# Altium schematic sheet main.SchDoc
size A3
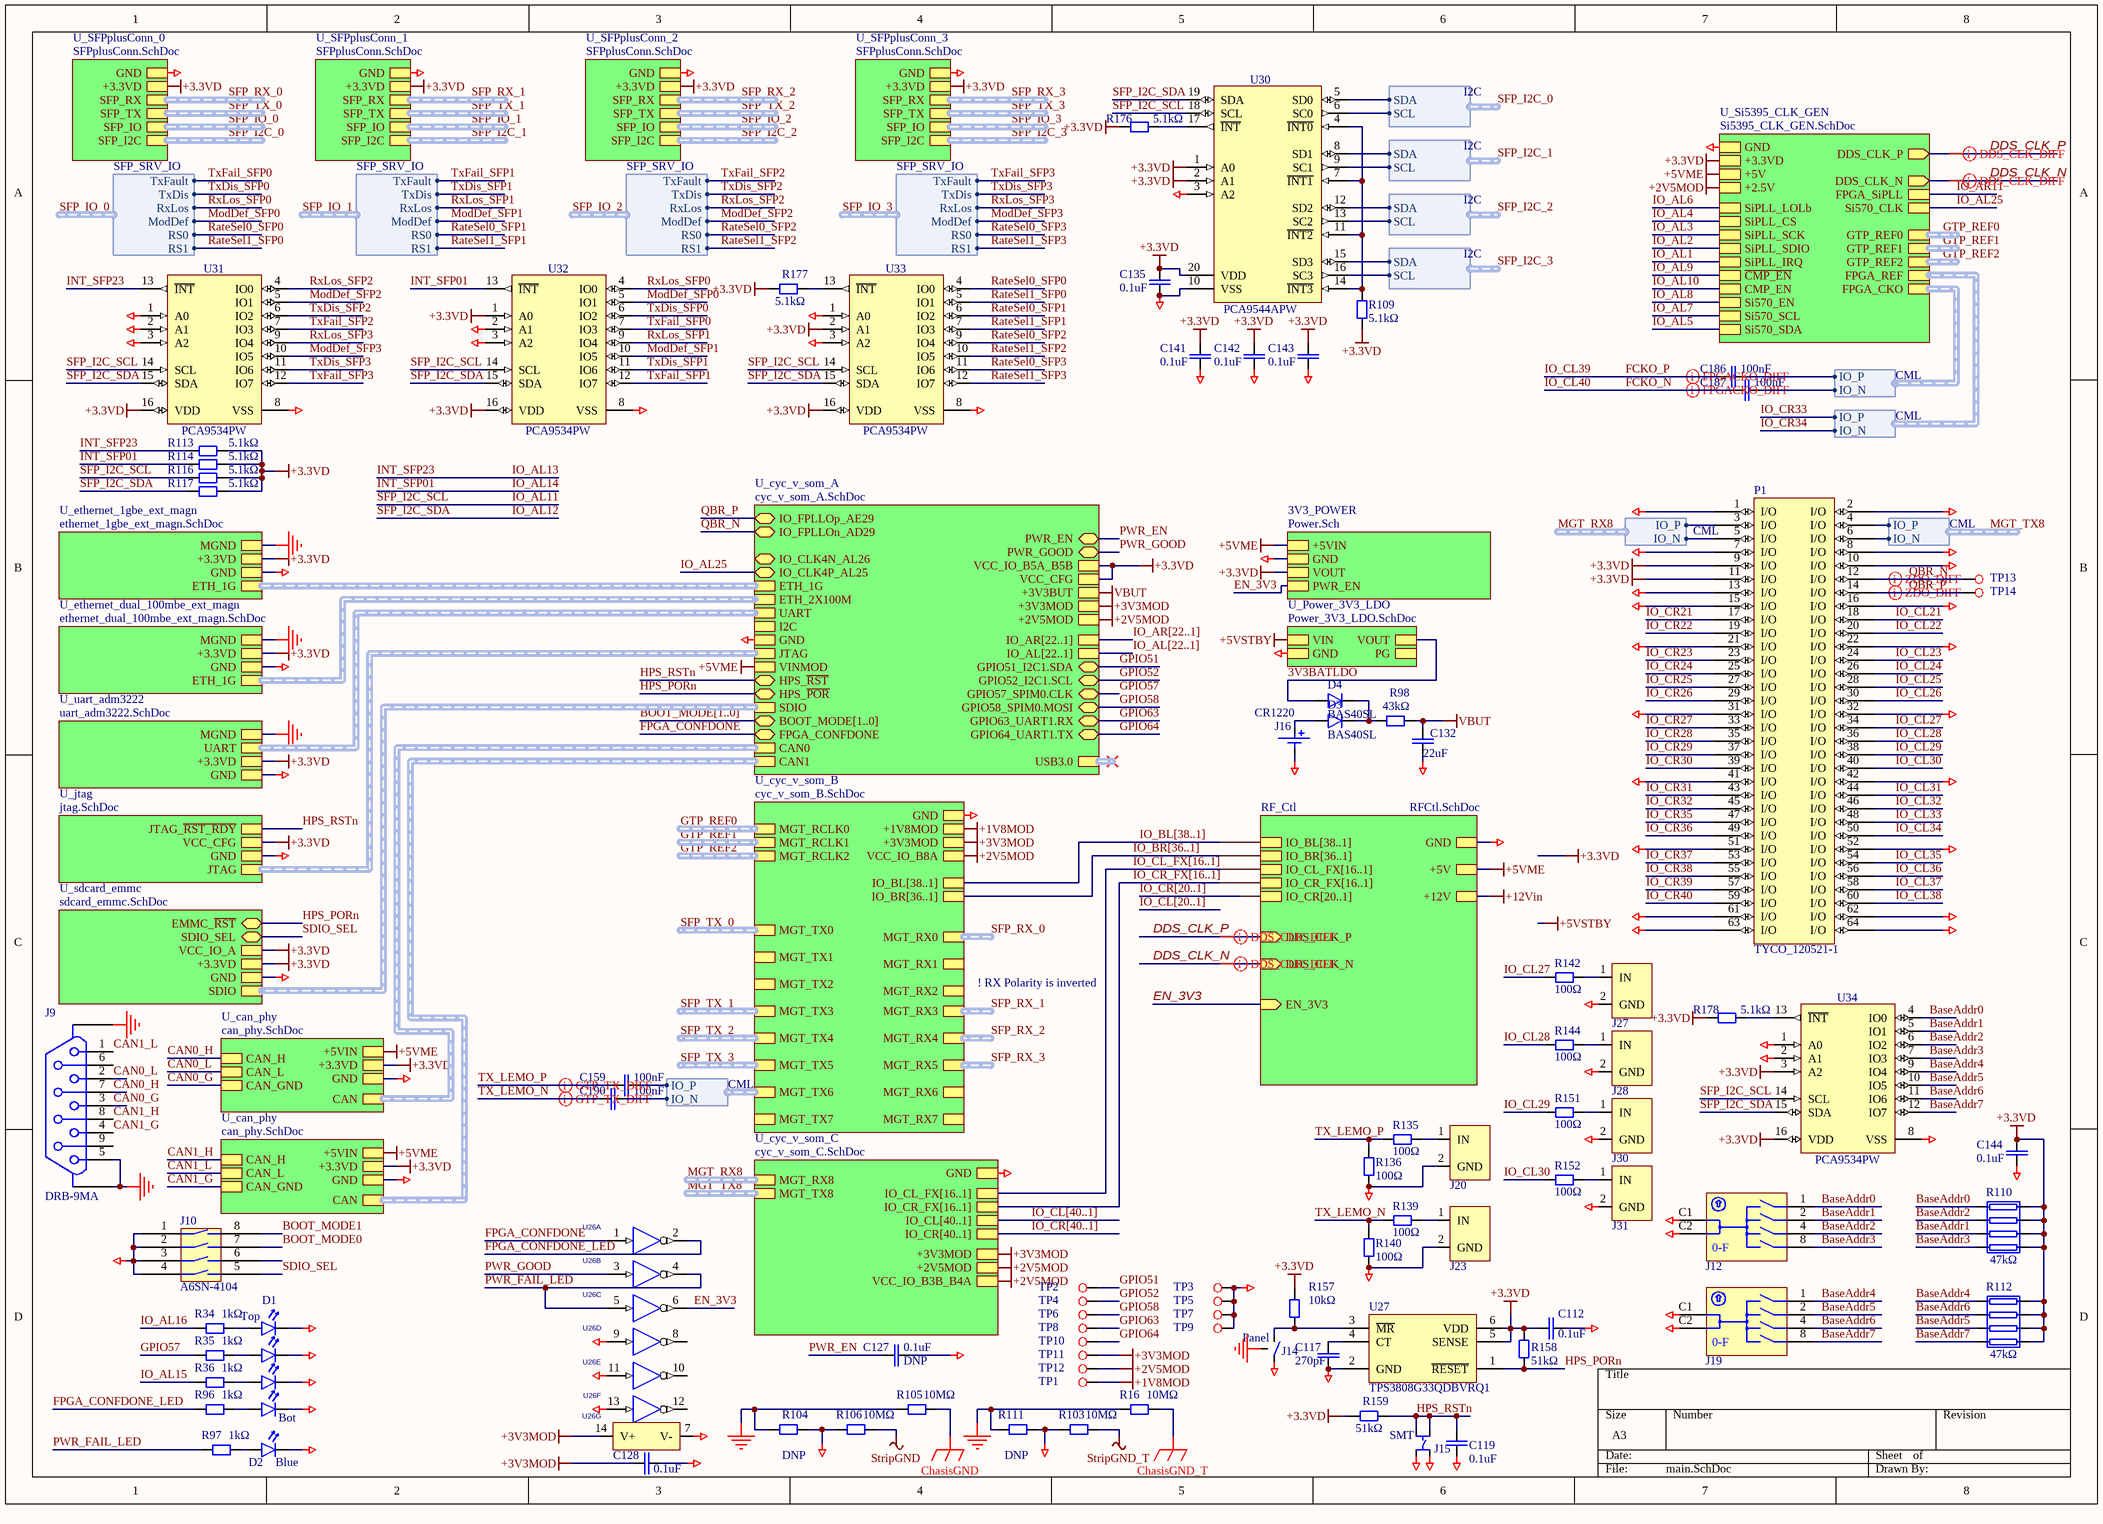
[diagram p0: main.SchDoc]

## Parts
C112  0.1uF  [CAPC2012N]
C117  270pF  [CAPC2012N]
C119  0.1uF  [CAPC2012N]
C127  PartField: 0.1uF  [CAPC2012N]  (hidden comment: DNP)
C128  0.1uF  [CAPC2012N]
C132  22uF  [CAPC2012N]
C135  0.1uF  [CAPC2012N]
C141  0.1uF  [CAPC2012N]
C142  0.1uF  [CAPC2012N]
C143  0.1uF  [CAPC2012N]
C144  0.1uF  [CAPC2012N]
C159  100nF  [CAPC1608N]
C186  100nF  [CAPC1608N]
C187  100nF  [CAPC1608N]
C190  100nF  [CAPC1608N]
D1  H485CGDL  [LED_H485C]  (value not drawn)
D2  Color: Blue  [LEDC1608N]  (hidden comment: LB Q39E-N1OO-35-1)
D3  BAS40SL  [SOD_923]
D4  BAS40SL  [SOD_923]
J9  DRB-9MA  [DRB-9MA]
J10  A6SN-4104  [DIPSW4-A6SN8]
J12  ERD116XSZ  [SW_ECE_ERD116XSZ]  (value not drawn)
J14  PTS645VL582LFS  [PTS645VL582LFS]  (value not drawn)
J15  PTS645SL43SMTR92  [PTS645SL43SMTR92]  (value not drawn)
J16  BC501SM  [BAT_CR1220]  (value not drawn)
J19  ERD116XSZ  [SW_ECE_ERD116XSZ]  (value not drawn)
J20  DNP  [LEMO_EPA.00.250.NTN]  (value not drawn)
J23  DNP  [LEMO_EPA.00.250.NTN]  (value not drawn)
J27  DNP  [LEMO_EPA.00.250.NTN]  (value not drawn)
J28  DNP  [LEMO_EPA.00.250.NTN]  (value not drawn)
J30  DNP  [LEMO_EPA.00.250.NTN]  (value not drawn)
J31  DNP  [LEMO_EPA.00.250.NTN]  (value not drawn)
P1  TYCO_120521-1  [TYCO_120521-1]
R16  10MΩ  [RESC2012N]
R34  1kΩ  [RESC2012N]
R35  1kΩ  [RESC2012N]
R36  1kΩ  [RESC2012N]
R96  1kΩ  [RESC2012N]
R97  1kΩ  [RESC2012N]
R98  43kΩ  [RESC2012N]
R103  10MΩ  [RESC2012N]
R104  DNP  [RESC2012N]
R105  10MΩ  [RESC2012N]
R106  10MΩ  [RESC2012N]
R109  5.1kΩ  [RESC2012N]
R110  value 47kΩ  [CAY16-J4]  (hidden comment: CAY16-4702F4LF)
R111  DNP  [RESC2012N]
R112  value 47kΩ  [CAY16-J4]  (hidden comment: CAY16-4702F4LF)
R113  5.1kΩ  [RESC2012N]
R114  5.1kΩ  [RESC2012N]
R116  5.1kΩ  [RESC2012N]
R117  5.1kΩ  [RESC2012N]
R135  100Ω  [RESC1608N]
R136  100Ω  [RESC1608N]
R139  100Ω  [RESC1608N]
R140  100Ω  [RESC1608N]
R142  100Ω  [RESC1608N]
R144  100Ω  [RESC1608N]
R151  100Ω  [RESC1608N]
R152  100Ω  [RESC1608N]
R157  10kΩ  [RESC2012N]
R158  51kΩ  [RESC2012N]
R159  51kΩ  [RESC2012N]
R176  5.1kΩ  [RESC2012N]
R177  5.1kΩ  [RESC2012N]
R178  5.1kΩ  [RESC2012N]
TP1  test point  [TEST_POINT]  (value not drawn)  (no BOM)
TP2  test point  [TEST_POINT]  (value not drawn)  (no BOM)
TP3  test point  [TEST_POINT]  (value not drawn)  (no BOM)
TP4  test point  [TEST_POINT]  (value not drawn)  (no BOM)
TP5  test point  [TEST_POINT]  (value not drawn)  (no BOM)
TP6  test point  [TEST_POINT]  (value not drawn)  (no BOM)
TP7  test point  [TEST_POINT]  (value not drawn)  (no BOM)
TP8  test point  [TEST_POINT]  (value not drawn)  (no BOM)
TP9  test point  [TEST_POINT]  (value not drawn)  (no BOM)
TP10  test point  [TEST_POINT]  (value not drawn)  (no BOM)
TP11  test point  [TEST_POINT]  (value not drawn)  (no BOM)
TP12  test point  [TEST_POINT]  (value not drawn)  (no BOM)
TP13  test point  [TEST_POINT]  (value not drawn)  (no BOM)
TP14  test point  [TEST_POINT]  (value not drawn)  (no BOM)
U26  SN74LVC04APW  [SOP65P640X110-14N]  (value not drawn)  (parts A,B,C,D,E,F,G of 7)
U27  TPS3808G33QDBVRQ1  [SOT95P280X100-6N]
U30  PCA9544APW  [SOP65P640X110-20N]
U31  PCA9534PW  [SOP65P640X110-16N]
U32  PCA9534PW  [SOP65P640X110-16N]
U33  PCA9534PW  [SOP65P640X110-16N]
U34  PCA9534PW  [SOP65P640X110-16N]

## Sub-sheets
3V3_POWER = Power.Sch: +5VIN, GND, VOUT, PWR_EN
RF_Ctl = RFCtl.SchDoc: IO_CR[20..1], IO_BL[38..1], IO_BR[36..1], IO_CL_FX[16..1], IO_CR_FX[16..1], DDS_CLK_P (in), DDS_CLK_N (in), EN_3V3 (in), GND, +5V, +12V
U_can_phy = can_phy.SchDoc: CAN (harness CAN), GND, +3.3VD, CAN_H, CAN_L, CAN_GND, +5VIN
U_can_phy = can_phy.SchDoc: CAN (harness CAN), GND, +3.3VD, CAN_H, CAN_L, CAN_GND, +5VIN
U_cyc_v_som_A = cyc_v_som_A.SchDoc: ETH_1G (harness EthLanes), ETH_2X100M (harness EthLanes), UART (harness UART), I2C (harness I2C), GND, JTAG (harness JTAG), VINMOD, HPS_~{RST} (bidir), HPS_~{POR} (bidir), SDIO (harness SDIO), BOOT_MODE[1..0] (bidir), FPGA_CONFDONE (bidir), CAN0 (harness CAN), CAN1 (harness CAN), IO_AR[22..1], +2V5MOD, +3V3MOD, GPIO52_I2C1.SCL (bidir), GPIO63_UART1.RX (bidir), GPIO51_I2C1.SDA (bidir), GPIO57_SPIM0.CLK (bidir), GPIO64_UART1.TX (bidir), USB3.0 (harness USB3), GPIO58_SPIM0.MOSI (bidir), +3V3BUT, IO_CLK4N_AL26 (bidir), IO_CLK4P_AL25 (bidir), PWR_EN (bidir), PWR_GOOD (bidir), VCC_IO_B5A_B5B, VCC_CFG, IO_FPLLOp_AE29 (bidir), IO_AL[22..1], IO_FPLLOn_AD29 (bidir)
U_cyc_v_som_B = cyc_v_som_B.SchDoc: GND, MGT_RCLK2 (harness CML), MGT_RCLK1 (harness CML), IO_BL[38..1], IO_BR[36..1], MGT_RCLK0 (harness CML), +1V8MOD, +3V3MOD, VCC_IO_B8A, MGT_TX5 (harness CML), MGT_TX3 (harness CML), MGT_TX6 (harness CML), MGT_TX7 (harness CML), MGT_TX2 (harness CML), MGT_TX1 (harness CML), MGT_TX4 (harness CML), MGT_TX0 (harness CML), MGT_RX0 (harness CML), MGT_RX1 (harness CML), MGT_RX6 (harness CML), MGT_RX4 (harness CML), MGT_RX5 (harness CML), MGT_RX3 (harness CML), MGT_RX2 (harness CML), MGT_RX7 (harness CML)
U_cyc_v_som_C = cyc_v_som_C.SchDoc: GND, MGT_TX8 (harness CML), IO_CL_FX[16..1], IO_CR_FX[16..1], MGT_RX8 (harness CML), IO_CL[40..1], IO_CR[40..1], +3V3MOD, +2V5MOD, VCC_IO_B3B_B4A
U_ethernet_1gbe_ext_magn = ethernet_1gbe_ext_magn.SchDoc: ETH_1G (harness EthLanes), GND, +3.3VD, MGND
U_ethernet_dual_100mbe_ext_magn = ethernet_dual_100mbe_ext_magn.SchDoc: ETH_1G (harness EthLanes), GND, +3.3VD, MGND
U_jtag = jtag.SchDoc: JTAG (harness JTAG), GND, VCC_CFG, JTAG_~{RST_RDY}
U_Power_3V3_LDO = Power_3V3_LDO.SchDoc: GND, VOUT, VIN, PG
U_sdcard_emmc = sdcard_emmc.SchDoc: SDIO (harness SDIO), GND, +3.3VD, VCC_IO_A, SDIO_SEL (bidir), EMMC_~{RST} (bidir)
U_SFPplusConn_0 = SFPplusConn.SchDoc: GND, +3.3VD, SFP_TX (harness CML), SFP_RX (harness CML), SFP_IO (harness SFP_SRV_IO), SFP_I2C (harness I2C)
U_SFPplusConn_1 = SFPplusConn.SchDoc: GND, +3.3VD, SFP_TX (harness CML), SFP_RX (harness CML), SFP_IO (harness SFP_SRV_IO), SFP_I2C (harness I2C)
U_SFPplusConn_2 = SFPplusConn.SchDoc: GND, +3.3VD, SFP_TX (harness CML), SFP_RX (harness CML), SFP_IO (harness SFP_SRV_IO), SFP_I2C (harness I2C)
U_SFPplusConn_3 = SFPplusConn.SchDoc: GND, +3.3VD, SFP_TX (harness CML), SFP_RX (harness CML), SFP_IO (harness SFP_SRV_IO), SFP_I2C (harness I2C)
U_Si5395_CLK_GEN = Si5395_CLK_GEN.SchDoc: GND, +3.3VD, +5V, Si570_CLK, Si570_SCL, Si570_SDA, Si570_EN, ~{CMP_EN}, CMP_EN, +2.5V, FPGA_SiPLL, GTP_REF1 (harness CML), GTP_REF0 (harness CML), GTP_REF2 (harness CML), FPGA_CKO (harness CML), SiPLL_IRQ, SiPLL_SDIO, SiPLL_SCK, SiPLL_CS, FPGA_REF (harness CML), SiPLL_LOLb, DDS_CLK_P (out), DDS_CLK_N (out)
U_uart_adm3222 = uart_adm3222.SchDoc: GND, +3.3VD, UART (harness UART), MGND

## Harnesses
I2C: SDA, SCL
SFP_SRV_IO: TxDis, TxFault, RS0, RS1, ModDef, RxLos
CML: IO_N, IO_P

## Nets
+1V8MOD: TP1.1 ; sheet U_cyc_v_som_B/+1V8MOD
+2V5MOD: TP12.1 ; sheet U_cyc_v_som_A/+2V5MOD, sheet U_cyc_v_som_B/VCC_IO_B8A, sheet U_cyc_v_som_C/+2V5MOD, sheet U_cyc_v_som_C/VCC_IO_B3B_B4A, sheet U_Si5395_CLK_GEN/+2.5V
+3.3VD: C112.2 C135.1 C141.1 C142.1 C143.1 C144.1 P1.9(I/O) P1.11(I/O) R109.2 R110.5 R110.6 R110.7 R110.8 R112.5 R112.6 R112.7 R112.8 R113.2 R114.2 R116.2 R117.2 R157.1 R158.1 R159.1 R176.1 R177.1 R178.1 U27.5(SENSE) U27.6(VDD) U30.1(A0) U30.2(A1) U30.20(VDD) U31.16(VDD) U32.1(A0) U32.16(VDD) U33.2(A1) U33.16(VDD) U34.3(A2) U34.16(VDD) ; sheet U_cyc_v_som_A/VCC_IO_B5A_B5B, sheet U_cyc_v_som_A/VCC_CFG, sheet U_ethernet_1gbe_ext_magn/+3.3VD, sheet U_ethernet_dual_100mbe_ext_magn/+3.3VD, sheet U_uart_adm3222/+3.3VD, sheet U_jtag/VCC_CFG, sheet U_sdcard_emmc/+3.3VD, sheet U_sdcard_emmc/VCC_IO_A, sheet 3V3_POWER/VOUT, sheet U_can_phy/+3.3VD, sheet U_can_phy/+3.3VD, sheet U_SFPplusConn_0/+3.3VD, sheet U_SFPplusConn_1/+3.3VD, sheet U_SFPplusConn_2/+3.3VD, sheet U_SFPplusConn_3/+3.3VD, sheet U_Si5395_CLK_GEN/+3.3VD
+3V3MOD: C128.2 TP11.1 U26.14(V+) ; sheet U_cyc_v_som_A/+3V3MOD, sheet U_cyc_v_som_B/+3V3MOD, sheet U_cyc_v_som_C/+3V3MOD
+5VME: sheet U_cyc_v_som_A/VINMOD, sheet 3V3_POWER/+5VIN, sheet U_can_phy/+5VIN, sheet U_can_phy/+5VIN, sheet U_Si5395_CLK_GEN/+5V, sheet RF_Ctl/+5V
+5VSTBY: sheet U_Power_3V3_LDO/VIN
+12Vin: sheet RF_Ctl/+12V
ChasisGND: R105.2
ChasisGND_T: R16.2
GND: C112.1 C117.2 C119.2 C127.1 C128.1 C132.1 C135.2 C141.2 C142.2 C143.2 C144.2 D1.2(C) D1.4(C) D1.6(C) D1.8(C) D2.1(C) J10.1 J10.2 J10.3 J10.4 J12.C1(C) J12.C2(C) J14.2 J15.3 J15.4 J16.2(-) J19.C1(C) J19.C2(C) J20.2(GND) J23.2(GND) J27.2(GND) J28.2(GND) J30.2(GND) J31.2(GND) P1.1(I/O) P1.2(I/O) P1.7(I/O) P1.8(I/O) P1.10(I/O) P1.13(I/O) P1.15(I/O) P1.16(I/O) P1.21(I/O) P1.22(I/O) P1.31(I/O) P1.32(I/O) P1.41(I/O) P1.42(I/O) P1.51(I/O) P1.52(I/O) P1.61(I/O) P1.62(I/O) P1.63(I/O) P1.64(I/O) R103.1 R104.2 R106.1 R111.2 R136.2 R140.2 TP3.1 TP5.1 TP7.1 TP9.1 U26.7(V-) U26.9(A) U26.11(A) U26.13(A) U27.2(GND) U30.3(A2) U30.10(VSS) U31.1(A0) U31.2(A1) U31.3(A2) U31.8(VSS) U32.2(A1) U32.3(A2) U32.8(VSS) U33.1(A0) U33.3(A2) U33.8(VSS) U34.1(A0) U34.2(A1) U34.8(VSS) ; sheet U_cyc_v_som_A/GND, sheet U_cyc_v_som_B/GND, sheet U_cyc_v_som_C/GND, sheet U_ethernet_1gbe_ext_magn/GND, sheet U_ethernet_dual_100mbe_ext_magn/GND, sheet U_uart_adm3222/GND, sheet U_jtag/GND, sheet U_sdcard_emmc/GND, sheet 3V3_POWER/GND, sheet U_can_phy/GND, sheet U_can_phy/GND, sheet U_Power_3V3_LDO/GND, sheet U_SFPplusConn_0/GND, sheet U_SFPplusConn_1/GND, sheet U_SFPplusConn_2/GND, sheet U_SFPplusConn_3/GND, sheet U_Si5395_CLK_GEN/GND, sheet RF_Ctl/GND
MGND: J9.5 J9.S1(SHLD) J9.S2(SHLD) J14.0(S) R16.1 R104.1 R105.1 R111.1 ; sheet U_ethernet_1gbe_ext_magn/MGND, sheet U_ethernet_dual_100mbe_ext_magn/MGND, sheet U_uart_adm3222/MGND
StripGND: R106.2
StripGND_T: R103.2
VBUT: C132.2 R98.1 ; sheet U_cyc_v_som_A/+3V3BUT
3V3BATLDO: D4.1(A) ; sheet U_Power_3V3_LDO/VOUT
BaseAddr0: J12.1 R110.4 U34.4(IO0)
BaseAddr1: J12.2 R110.2 U34.5(IO1)
BaseAddr2: J12.4 R110.3 U34.6(IO2)
BaseAddr3: J12.8 R110.1 U34.7(IO3)
BaseAddr4: J19.1 R112.4 U34.9(IO4)
BaseAddr5: J19.2 R112.2 U34.10(IO5)
BaseAddr6: J19.4 R112.3 U34.11(IO6)
BaseAddr7: J19.8 R112.1 U34.12(IO7)
BOOT_MODE0: J10.7
BOOT_MODE1: J10.8
CAN0_G: J9.3 ; sheet U_can_phy/CAN_GND
CAN0_H: J9.7 ; sheet U_can_phy/CAN_H
CAN0_L: J9.2 ; sheet U_can_phy/CAN_L
CAN1_G: J9.4 ; sheet U_can_phy/CAN_GND
CAN1_H: J9.8 ; sheet U_can_phy/CAN_H
CAN1_L: J9.1 ; sheet U_can_phy/CAN_L
DDS_CLK_N: sheet U_Si5395_CLK_GEN/DDS_CLK_N, sheet RF_Ctl/DDS_CLK_N
DDS_CLK_P: sheet U_Si5395_CLK_GEN/DDS_CLK_P, sheet RF_Ctl/DDS_CLK_P
EN_3V3: U26.6(B) ; sheet 3V3_POWER/PWR_EN, sheet RF_Ctl/EN_3V3
FCKO_N: C187.1  [also labelled IO_CL40]
FCKO_P: C186.1  [also labelled IO_CL39]
FPGA_CONFDONE: U26.1(A) ; sheet U_cyc_v_som_A/FPGA_CONFDONE
FPGA_CONFDONE_LED: R96.1 U26.2(B)
GPIO51: TP2.1 ; sheet U_cyc_v_som_A/GPIO51_I2C1.SDA
GPIO52: TP4.1 ; sheet U_cyc_v_som_A/GPIO52_I2C1.SCL
GPIO57: R35.1 ; sheet U_cyc_v_som_A/GPIO57_SPIM0.CLK
GPIO58: TP6.1 ; sheet U_cyc_v_som_A/GPIO58_SPIM0.MOSI
GPIO63: TP8.1 ; sheet U_cyc_v_som_A/GPIO63_UART1.RX
GPIO64: TP10.1 ; sheet U_cyc_v_som_A/GPIO64_UART1.TX
HPS_PORn: R158.2 U27.1(~{RESET}) ; sheet U_cyc_v_som_A/HPS_~{POR}, sheet U_sdcard_emmc/EMMC_~{RST}
HPS_RSTn: C119.1 J15.1 J15.2 R159.2 ; sheet U_cyc_v_som_A/HPS_~{RST}, sheet U_jtag/JTAG_~{RST_RDY}
INT_SFP01: R114.1 U32.13(~{INT})  [also labelled IO_AL14]
INT_SFP23: R113.1 U31.13(~{INT})  [also labelled IO_AL13]
IO_AL1: sheet U_Si5395_CLK_GEN/SiPLL_IRQ
IO_AL2: sheet U_Si5395_CLK_GEN/SiPLL_SDIO
IO_AL3: sheet U_Si5395_CLK_GEN/SiPLL_SCK
IO_AL4: sheet U_Si5395_CLK_GEN/SiPLL_CS
IO_AL5: sheet U_Si5395_CLK_GEN/Si570_SDA
IO_AL6: sheet U_Si5395_CLK_GEN/SiPLL_LOLb
IO_AL7: sheet U_Si5395_CLK_GEN/Si570_SCL
IO_AL8: sheet U_Si5395_CLK_GEN/Si570_EN
IO_AL9: sheet U_Si5395_CLK_GEN/~{CMP_EN}
IO_AL10: sheet U_Si5395_CLK_GEN/CMP_EN
IO_AL11: R116.1 U30.18(SCL) U31.14(SCL) U32.14(SCL) U33.14(SCL) U34.14(SCL)  [also labelled SFP_I2C_SCL]
IO_AL12: R117.1 U30.19(SDA) U31.15(SDA) U32.15(SDA) U33.15(SDA) U34.15(SDA)  [also labelled SFP_I2C_SDA]
IO_AL15: R36.1
IO_AL16: R34.1
IO_AL25: sheet U_cyc_v_som_A/IO_CLK4P_AL25, sheet U_Si5395_CLK_GEN/Si570_CLK
IO_AR11: sheet U_Si5395_CLK_GEN/FPGA_SiPLL
IO_CL21: P1.18(I/O)
IO_CL22: P1.20(I/O)
IO_CL23: P1.24(I/O)
IO_CL24: P1.26(I/O)
IO_CL25: P1.28(I/O)
IO_CL26: P1.30(I/O)
IO_CL27: P1.34(I/O) R142.2
IO_CL28: P1.36(I/O) R144.2
IO_CL29: P1.38(I/O) R151.2
IO_CL30: P1.40(I/O) R152.2
IO_CL31: P1.44(I/O)
IO_CL32: P1.46(I/O)
IO_CL33: P1.48(I/O)
IO_CL34: P1.50(I/O)
IO_CL35: P1.54(I/O)
IO_CL36: P1.56(I/O)
IO_CL37: P1.58(I/O)
IO_CL38: P1.60(I/O)
IO_CR21: P1.17(I/O)
IO_CR22: P1.19(I/O)
IO_CR23: P1.23(I/O)
IO_CR24: P1.25(I/O)
IO_CR25: P1.27(I/O)
IO_CR26: P1.29(I/O)
IO_CR27: P1.33(I/O)
IO_CR28: P1.35(I/O)
IO_CR29: P1.37(I/O)
IO_CR30: P1.39(I/O)
IO_CR31: P1.43(I/O)
IO_CR32: P1.45(I/O)
IO_CR33: sheet U_Si5395_CLK_GEN/FPGA_REF.IO_P
IO_CR34: sheet U_Si5395_CLK_GEN/FPGA_REF.IO_N
IO_CR35: P1.47(I/O)
IO_CR36: P1.49(I/O)
IO_CR37: P1.53(I/O)
IO_CR38: P1.55(I/O)
IO_CR39: P1.57(I/O)
IO_CR40: P1.59(I/O)
MGT_RX8.IO_N: P1.5(I/O) ; sheet U_cyc_v_som_C/MGT_RX8.IO_N
MGT_RX8.IO_P: P1.3(I/O) ; sheet U_cyc_v_som_C/MGT_RX8.IO_P
MGT_TX8.IO_N: P1.6(I/O) ; sheet U_cyc_v_som_C/MGT_TX8.IO_N
MGT_TX8.IO_P: P1.4(I/O) ; sheet U_cyc_v_som_C/MGT_TX8.IO_P
ModDef_SFP0: U32.5(IO1) ; sheet U_SFPplusConn_0/SFP_IO.ModDef
ModDef_SFP1: U32.10(IO5) ; sheet U_SFPplusConn_1/SFP_IO.ModDef
ModDef_SFP2: U31.5(IO1) ; sheet U_SFPplusConn_2/SFP_IO.ModDef
ModDef_SFP3: U31.10(IO5) ; sheet U_SFPplusConn_3/SFP_IO.ModDef
PWR_EN: C127.2 ; sheet U_cyc_v_som_A/PWR_EN
PWR_FAIL_LED: R97.1 U26.4(B) U26.5(A)
PWR_GOOD: U26.3(A) ; sheet U_cyc_v_som_A/PWR_GOOD
QBR_N: P1.12(I/O) TP13.1 ; sheet U_cyc_v_som_A/IO_FPLLOn_AD29
QBR_P: P1.14(I/O) TP14.1 ; sheet U_cyc_v_som_A/IO_FPLLOp_AE29
RateSel0_SFP0: U33.4(IO0) ; sheet U_SFPplusConn_0/SFP_IO.RS0
RateSel0_SFP1: U33.6(IO2) ; sheet U_SFPplusConn_1/SFP_IO.RS0
RateSel0_SFP2: U33.9(IO4) ; sheet U_SFPplusConn_2/SFP_IO.RS0
RateSel0_SFP3: U33.11(IO6) ; sheet U_SFPplusConn_3/SFP_IO.RS0
RateSel1_SFP0: U33.5(IO1) ; sheet U_SFPplusConn_0/SFP_IO.RS1
RateSel1_SFP1: U33.7(IO3) ; sheet U_SFPplusConn_1/SFP_IO.RS1
RateSel1_SFP2: U33.10(IO5) ; sheet U_SFPplusConn_2/SFP_IO.RS1
RateSel1_SFP3: U33.12(IO7) ; sheet U_SFPplusConn_3/SFP_IO.RS1
RxLos_SFP0: U32.4(IO0) ; sheet U_SFPplusConn_0/SFP_IO.RxLos
RxLos_SFP1: U32.9(IO4) ; sheet U_SFPplusConn_1/SFP_IO.RxLos
RxLos_SFP2: U31.4(IO0) ; sheet U_SFPplusConn_2/SFP_IO.RxLos
RxLos_SFP3: U31.9(IO4) ; sheet U_SFPplusConn_3/SFP_IO.RxLos
SDIO_SEL: J10.5 ; sheet U_sdcard_emmc/SDIO_SEL
SFP_I2C_0.SCL: U30.6(SC0) ; sheet U_SFPplusConn_0/SFP_I2C.SCL
SFP_I2C_0.SDA: U30.5(SD0) ; sheet U_SFPplusConn_0/SFP_I2C.SDA
SFP_I2C_1.SCL: U30.9(SC1) ; sheet U_SFPplusConn_1/SFP_I2C.SCL
SFP_I2C_1.SDA: U30.8(SD1) ; sheet U_SFPplusConn_1/SFP_I2C.SDA
SFP_I2C_2.SCL: U30.13(SC2) ; sheet U_SFPplusConn_2/SFP_I2C.SCL
SFP_I2C_2.SDA: U30.12(SD2) ; sheet U_SFPplusConn_2/SFP_I2C.SDA
SFP_I2C_3.SCL: U30.16(SC3) ; sheet U_SFPplusConn_3/SFP_I2C.SCL
SFP_I2C_3.SDA: U30.15(SD3) ; sheet U_SFPplusConn_3/SFP_I2C.SDA
TX_LEMO_N: C190.1 R139.2 R140.1
TX_LEMO_P: C159.1 R135.2 R136.1
TxDis_SFP0: U32.6(IO2) ; sheet U_SFPplusConn_0/SFP_IO.TxDis  [project net SFP_IO_0.TxDis]
TxDis_SFP1: U32.11(IO6) ; sheet U_SFPplusConn_1/SFP_IO.TxDis  [project net SFP_IO_1.TxDis]
TxDis_SFP2: U31.6(IO2) ; sheet U_SFPplusConn_2/SFP_IO.TxDis  [project net SFP_IO_2.TxDis]
TxDis_SFP3: U31.11(IO6) ; sheet U_SFPplusConn_3/SFP_IO.TxDis  [project net SFP_IO_3.TxDis]
TxFail_SFP0: U32.7(IO3) ; sheet U_SFPplusConn_0/SFP_IO.TxFault  [project net SFP_IO_0.TxFault]
TxFail_SFP1: U32.12(IO7) ; sheet U_SFPplusConn_1/SFP_IO.TxFault  [project net SFP_IO_1.TxFault]
TxFail_SFP2: U31.7(IO3) ; sheet U_SFPplusConn_2/SFP_IO.TxFault  [project net SFP_IO_2.TxFault]
TxFail_SFP3: U31.12(IO7) ; sheet U_SFPplusConn_3/SFP_IO.TxFault  [project net SFP_IO_3.TxFault]
NetC117_1: C117.1 U27.4(CT)
NetC159_2: C159.2 ; sheet U_cyc_v_som_B/MGT_TX6.IO_P
NetC186_2: C186.2 ; sheet U_Si5395_CLK_GEN/FPGA_CKO.IO_P
NetC187_2: C187.2 ; sheet U_Si5395_CLK_GEN/FPGA_CKO.IO_N
NetC190_2: C190.2 ; sheet U_cyc_v_som_B/MGT_TX6.IO_N
NetD1_1: D1.1(A) R96.2
NetD1_3: D1.3(A) R36.2
NetD1_5: D1.5(A) R35.2
NetD1_7: D1.7(A) R34.2
NetD2_2: D2.2(A) R97.2
NetD3_1: D3.1(A) J16.1(+)
NetD3_2: D3.2(C) D4.2(C) R98.2
NetJ14_1: J14.1 R157.2 U27.3(~{MR})
NetJ20_1: J20.1(IN) R135.1
NetJ23_1: J23.1(IN) R139.1
NetJ27_1: J27.1(IN) R142.1
NetJ28_1: J28.1(IN) R144.1
NetJ30_1: J30.1(IN) R151.1
NetJ31_1: J31.1(IN) R152.1
NetR109_1: R109.1 U30.4(~{INT0}) U30.7(~{INT1}) U30.11(~{INT2}) U30.14(~{INT3})
NetR176_2: R176.2 U30.17(~{INT})
NetR177_2: R177.2 U33.13(~{INT})
NetR178_2: R178.2 U34.13(~{INT})

Not connected (* = marked no-connect by the designer): J9 6 9; J10 6; U26 8(B) 10(B) 12(B)

## Buses and harness runs
bus BOOT_MODE[1..0] = sheet U_cyc_v_som_A/BOOT_MODE[1..0]
bus IO_AL[22..1] = sheet U_cyc_v_som_A/IO_AL[22..1]
bus IO_AR[22..1] = sheet U_cyc_v_som_A/IO_AR[22..1]
bus IO_BL[38..1] = sheet RF_Ctl/IO_BL[38..1] = sheet U_cyc_v_som_B/IO_BL[38..1]
bus IO_BR[36..1] = sheet RF_Ctl/IO_BR[36..1] = sheet U_cyc_v_som_B/IO_BR[36..1]
bus IO_CL[20..1]
bus IO_CL[40..1] = sheet U_cyc_v_som_C/IO_CL[40..1]
bus IO_CL_FX[16..1] = sheet RF_Ctl/IO_CL_FX[16..1] = sheet U_cyc_v_som_C/IO_CL_FX[16..1]
bus IO_CR[20..1] = sheet RF_Ctl/IO_CR[20..1]
bus IO_CR[40..1] = sheet U_cyc_v_som_C/IO_CR[40..1]
bus IO_CR_FX[16..1] = sheet RF_Ctl/IO_CR_FX[16..1] = sheet U_cyc_v_som_C/IO_CR_FX[16..1]
harness GTP_REF0 = sheet U_cyc_v_som_B/MGT_RCLK0
harness GTP_REF0 = sheet U_Si5395_CLK_GEN/GTP_REF0
harness GTP_REF1 = sheet U_cyc_v_som_B/MGT_RCLK1
harness GTP_REF1 = sheet U_Si5395_CLK_GEN/GTP_REF1
harness GTP_REF2 = sheet U_cyc_v_som_B/MGT_RCLK2
harness GTP_REF2 = sheet U_Si5395_CLK_GEN/GTP_REF2
harness MGT_RX8 = sheet U_cyc_v_som_C/MGT_RX8
harness MGT_TX8 = sheet U_cyc_v_som_C/MGT_TX8
harness SFP_I2C_0 = sheet U_SFPplusConn_0/SFP_I2C
harness SFP_I2C_1 = sheet U_SFPplusConn_1/SFP_I2C
harness SFP_I2C_2 = sheet U_SFPplusConn_2/SFP_I2C
harness SFP_I2C_3 = sheet U_SFPplusConn_3/SFP_I2C
harness SFP_IO_0 = sheet U_SFPplusConn_0/SFP_IO
harness SFP_IO_1 = sheet U_SFPplusConn_1/SFP_IO
harness SFP_IO_2 = sheet U_SFPplusConn_2/SFP_IO
harness SFP_IO_3 = sheet U_SFPplusConn_3/SFP_IO
harness SFP_RX_0 = sheet U_cyc_v_som_B/MGT_RX0
harness SFP_RX_0 = sheet U_SFPplusConn_0/SFP_RX
harness SFP_RX_1 = sheet U_cyc_v_som_B/MGT_RX3
harness SFP_RX_1 = sheet U_SFPplusConn_1/SFP_RX
harness SFP_RX_2 = sheet U_cyc_v_som_B/MGT_RX4
harness SFP_RX_2 = sheet U_SFPplusConn_2/SFP_RX
harness SFP_RX_3 = sheet U_cyc_v_som_B/MGT_RX5
harness SFP_RX_3 = sheet U_SFPplusConn_3/SFP_RX
harness SFP_TX_0 = sheet U_cyc_v_som_B/MGT_TX0
harness SFP_TX_0 = sheet U_SFPplusConn_0/SFP_TX
harness SFP_TX_1 = sheet U_cyc_v_som_B/MGT_TX3
harness SFP_TX_1 = sheet U_SFPplusConn_1/SFP_TX
harness SFP_TX_2 = sheet U_cyc_v_som_B/MGT_TX4
harness SFP_TX_2 = sheet U_SFPplusConn_2/SFP_TX
harness SFP_TX_3 = sheet U_cyc_v_som_B/MGT_TX5
harness SFP_TX_3 = sheet U_SFPplusConn_3/SFP_TX
harness sheet U_can_phy/CAN = sheet U_cyc_v_som_A/CAN0
harness sheet U_can_phy/CAN = sheet U_cyc_v_som_A/CAN1
harness sheet U_cyc_v_som_A/ETH_1G = sheet U_ethernet_1gbe_ext_magn/ETH_1G
harness sheet U_cyc_v_som_A/ETH_2X100M = sheet U_ethernet_dual_100mbe_ext_magn/ETH_1G
harness sheet U_cyc_v_som_A/JTAG = sheet U_jtag/JTAG
harness sheet U_cyc_v_som_A/SDIO = sheet U_sdcard_emmc/SDIO
harness sheet U_cyc_v_som_A/UART = sheet U_uart_adm3222/UART

## Layout directives
differential pair; rule Differential Pairs Routing [Pref Gap = 0.175mm    Min Gap  = 0.075mm    Max Gap  = 0.5mmPref Width = 0.25mm    Min Width  = 0.075mm    Max Width  = 0.5mm]: DDS_CLK_N, DDS_CLK_P, FCKO_N, FCKO_P, TX_LEMO_N, TX_LEMO_P
differential pair; rule Differential Pairs Routing [Pref Gap = 0.175mm    Min Gap  = 0.075mm    Max Gap  = 0.5mmPref Width = 0.15mm    Min Width  = 0.075mm    Max Width  = 0.5mm]: QBR_N, QBR_P

## Notes on the sheet
- (near J16) CR1220
- ! RX Polarity is inverted
- (in symbol ERD116XSZ) 0-F
- (in symbol LEDx4_H485CGDL) Top; Bot
- (in symbol PTS645SL43SMTR92) SMT
- (in symbol PTS645VL582LFS) Panel

## Library data of the parts
C112 C117 C119 C127 C128 C132 C135 C141-C144 = CAPC: Generic ceramic SMD capacitor; Pkg: 0805; Maintainer: Evgeniy Kotov; SMD Solders: 2; THD Solders: 0; Last Change Data: 06.03.2017; Release Date: 06.03.2017
  C112 C119 C128 C135 C141-C144: PartField: 0.1uF; Value: 0.1uF
  C117: PartField: 270pF; Value: 270pF
  C127: Value: DNP
  C132: PartField: 22uF; Value: 22uF
C159 C186 C187 C190 = CAPC: Generic ceramic SMD capacitor; Pkg: 0603; Maintainer: Evgeniy Kotov; SMD Solders: 2; THD Solders: 0; PartField: 100nF; Last Change Data: 06.03.2017; Release Date: 06.03.2017; Value: 100nF
D1 = LEDx4_H485CGDL: LED Circuit Board Indicator 4 High Green (x 4) Diffused 2.1V Round with Domed Top, 1.80mm Through Hole; Pkg: 8 pin THD Led; Vendor: Bivar Inc.; Maintainer: Evgeniy Kotov; SMD Solders: 0; THD Solders: 8; Forward Current: 5mA; PartField: H485CGDL; Release Date: 28.03.2017; Last Change Data: 28.03.2017; Temperature Range: -55°C to +150°C; Value: H485CGDL; Color: Green
D2 = LED_SMD0603: SMD Led, 0603; Pkg: 0603; Vendor: Vishay; Maintainer: Evgeniy Kotov; SMD Solders: 2; THD Solders: 0; Forward Current: 5mA; PartField: LB Q39E-N1OO-35-1; Release Date: 28.03.2017; Last Change Data: 28.03.2017; Temperature Range: -55°C to +150°C; Value: LB Q39E-N1OO-35-1
D3 D4 = BAS40SL: Schottky Barrier Diode; Pkg: SOD-923F; Vendor: Vishay; Maintainer: Evgeniy Kotov; SMD Solders: 2; THD Solders: 0; Forward Current: 100mA; Reverse Voltage: 40V; Forward Voltage: 0.38V @ 1mA / 1V @ 40mA; Reverse Current: 15mA; PartField: BAS40SL; Release Date: 28.03.2017; Last Change Data: 28.03.2017; Temperature Range: -55°C to +150°C; Value: BAS40SL
J9 = DRB-9MA: D-SUB; 9-pin, male, flange 7.2mm; SolderOption: 0; THD Solders: 11; PartField: DRB-9MA; Value: DRB-9MA; Pkg: DRB-9MA; SMD Solders: 0
J10 = DIPSW4: SMD DIP Switch, Omron A6H or A6SN series; SMD Solders: 8; THD Solders: 0; Pkg: SMD 8pin; Value: A6SN-4104; Manufacturer: Omron; PartField: A6SN-4104
J12 J19 = ERD116XSZ: Vendor: ECE; SolderOption: 0; Pkg: Rotary 6pin; THD Solders: 6; Value: ERD116XSZ; PartField: ERD116XSZ; SMD Solders: 0
J14 = PTS645VL582LFS: Tactile Switch SPST-NO Side Actuated Through Hole, Right Angle; SMD Solders: 0; THD Solders: 4; Maintainer: Evgeniy Kotov; Pkg: Button 4 pin; PartField: PTS645VL582LFS; Last Change Data: 02.04.2017; Release Date: 02.04.2017; Value: PTS645VL582LFS; ComponentLink1Description: Datasheet
J15 = PTS645SL43SMTR92: Tactile Switch SPST-NO Top Actuated Surface Mount; SMD Solders: 4; THD Solders: 0; Maintainer: Evgeniy Kotov; Pkg: Button 4 pin; PartField: PTS645SL43SMTR92; Last Change Data: 02.04.2017; Release Date: 02.04.2017; Value: PTS645SL43SMTR92; ComponentLink1Description: Datasheet
J16 = BAT_CR1220: BATTERY HOLDER COIN 12.5MM SMD; SMD Solders: 2; THD Solders: 0; Maintainer: Evgeniy Kotov; Pkg: 12MM SMD; PartField: BC501SM; Last Change Data: 02.04.2017; Release Date: 02.04.2017; Value: BC501SM; ComponentLink1Description: Datasheet
J20 J23 J27 J28 J30 J31 = LEMO_EPA.00.250: PartField: EPA.00.250.NTN; SolderOption: 0; Pkg: LEMO 5pin; THD Solders: 5; Value: DNP; SMD Solders: 0
P1 = PCI_PMC_TYCO_120521-1: PCI Mezzanine Connector; IEEE 1386; Manufacturer: TE Connectivity; Value: DNP; SMD Solders: 64; THD Solders: 0; Pkg: SMD 64 pin; PartField: TYCO_120521-1
R16 R34-R36 R96-R98 R103 R105 R106 R109 R113 R114 R116 R117 R157-R159 R176-R178 = RESC: Resistor, Generic, SMD; Pkg: 0805; Maintainer: Evgeniy Kotov; SMD Solders: 2; THD Solders: 0; Release Date: 06.03.2017; Last Change Data: 09.03.2017
  R16 R103 R105 R106: PartField: 10MΩ; Value: 10MΩ
  R34-R36 R96 R97: PartField: 1kΩ; Value: 1kΩ
  R98: PartField: 43kΩ; Value: 43kΩ
  R109 R113 R114 R116 R117 R176-R178: PartField: 5.1kΩ; Value: 5.1kΩ
  R157: PartField: 10kΩ; Value: 10kΩ
  R158 R159: PartField: 51kΩ; Value: 51kΩ
R104 R111 = RESC: Resistor, Generic, SMD; PartField: 0Ω; Pkg: 0805; Maintainer: Evgeniy Kotov; SMD Solders: 2; THD Solders: 0; Release Date: 06.03.2017; Last Change Data: 09.03.2017; Value: DNP
R110 R112 = RESPACK4: Maintainer: Anton Pavlenko; Pkg: SMD 8pin; SMD Solders: 8; THD Solders: 0; PartField: CAY16-4702F4LF; Last Change Data: 16.05.2019; Release Date: 16.05.2019
R135 R136 R139 R140 R142 R144 R151 R152 = RESC: Resistor, Generic, SMD; Pkg: 0603; Maintainer: Evgeniy Kotov; SMD Solders: 2; THD Solders: 0; PartField: 100Ω; Release Date: 06.03.2017; Last Change Data: 09.03.2017; Value: 100Ω
TP1-TP14 = TestPoint: Vendor: BINP; SolderOption: 0; Pkg: DNP; PartField: test point; Value: test point; SMD Solders: 0; THD Solders: 0
U26 = SN74LVC04APW: Sextuple NOR Gate; Manufacturer: Texas Instruments; INDUSTRY_STD_PKG_TYPE: TSSOP; FAMILY_NAME: NOR_GATE; PIN_COUNT: 14; PACKAGE_DESIGNATOR: PW; Pkg: PW-14; THD Solders: 0; Value: SN74LVC04APW; HelpURL: http://www.ti.com/lit/ds/symlink/sn74lvc04a.pdf; GENERIC_PART_NUMBER: SN74LVC04APW; Vendor: Texas Instruments; Manufacturer_Part_Number: SN74LVC04APW; SMD Solders: 14; PartField: SN74LVC04APW
U27 = TPS3808G33QDBVRQ1: Low-Quiescent-Current Programmable-Delay Supervisory Circuit; Pkg: SOT23-6; SMD Solders: 6; THD Solders: 0; Maintainer: Evgeniy Kotov; Vendor: Texas Instruments; PartField: TPS3808G33QDBVRQ1; ComponentLink1URL: http://www.ti.com/lit/ds/symlink/dac7565.pdf; ComponentLink1Description: Datasheet; Last Change Date: 19.03.2017; Release Date: 19.03.2017; Value: TPS3808G33QDBVRQ1
U30 = PCA9544APW: 4-Channel I2C-Bus Multiplexer with Interrupt Logic; Manufacturer: NXP SEMICONDUCTORS; PressFit: No; Bonding: No; Pkg: SSOP20; SMD Solders: 20; THD Solders: 0; Part Number: PCA9544APW; Component Kind: Standard; Component Type: Standard; Device: PCA9544APW; PackageDescription: SOP, 20-Leads, Body 6.6x4.5mm (max), Pitch 0.65mm, IPC Medium Density; Part Description: 4-Channel I2C-Bus Multiplexer with Interrupt Logic; Manufacturer Part Number: PCA9544APW; Pin Count: 20; Case: SSOP20; Mounted: Yes; Socket: No; SMD: Yes; ComponentHeight: 1.1mm; Author: CERN DEM JLC; HelpURL: \\cern.ch\dfs\Applications\Altium\Datasheets\PCA9544APW.pdf; CreateDate: 06/10/2014; LatestRevisionDate: 06/10/2014; Sense: No; Value: PCA9544APW; PartField: PCA9544APW
U31-U34 = PCA9534PW: 8-Bit I2C-Bus and SMBus Low Power I/O Port with Interrupt; Manufacturer: ANALOG DEVICES; PressFit: No; Bonding: No; Pkg: SSOP16; SMD Solders: 16; THD Solders: 0; Part Number: PCA9534PW; Component Kind: Standard; Component Type: Standard; Device: PCA9534PW; PackageDescription: SOP, 0.65mm pitch; 16 pin, 4.40mm W X 5.00mm L X 1.10mm H body IPC Medium Density; Part Description: 8-Bit I2C-Bus and SMBus Low Power I/O Port with Interrupt; Manufacturer Part Number: PCA9534PW; Pin Count: 16; Case: SSOP16; Mounted: Yes; Socket: No; SMD: Yes; ComponentHeight: 1.1mm; Author: CERN DEM JLC; HelpURL: \\cern.ch\dfs\Applications\Altium\Datasheets\PCA9534PW.pdf; CreateDate: 18/12/2013; LatestRevisionDate: 18/12/2013; Sense: No; Value: PCA9534PW; PartField: PCA9534PW